# Altium project Pendulum_Project.PrjPcb
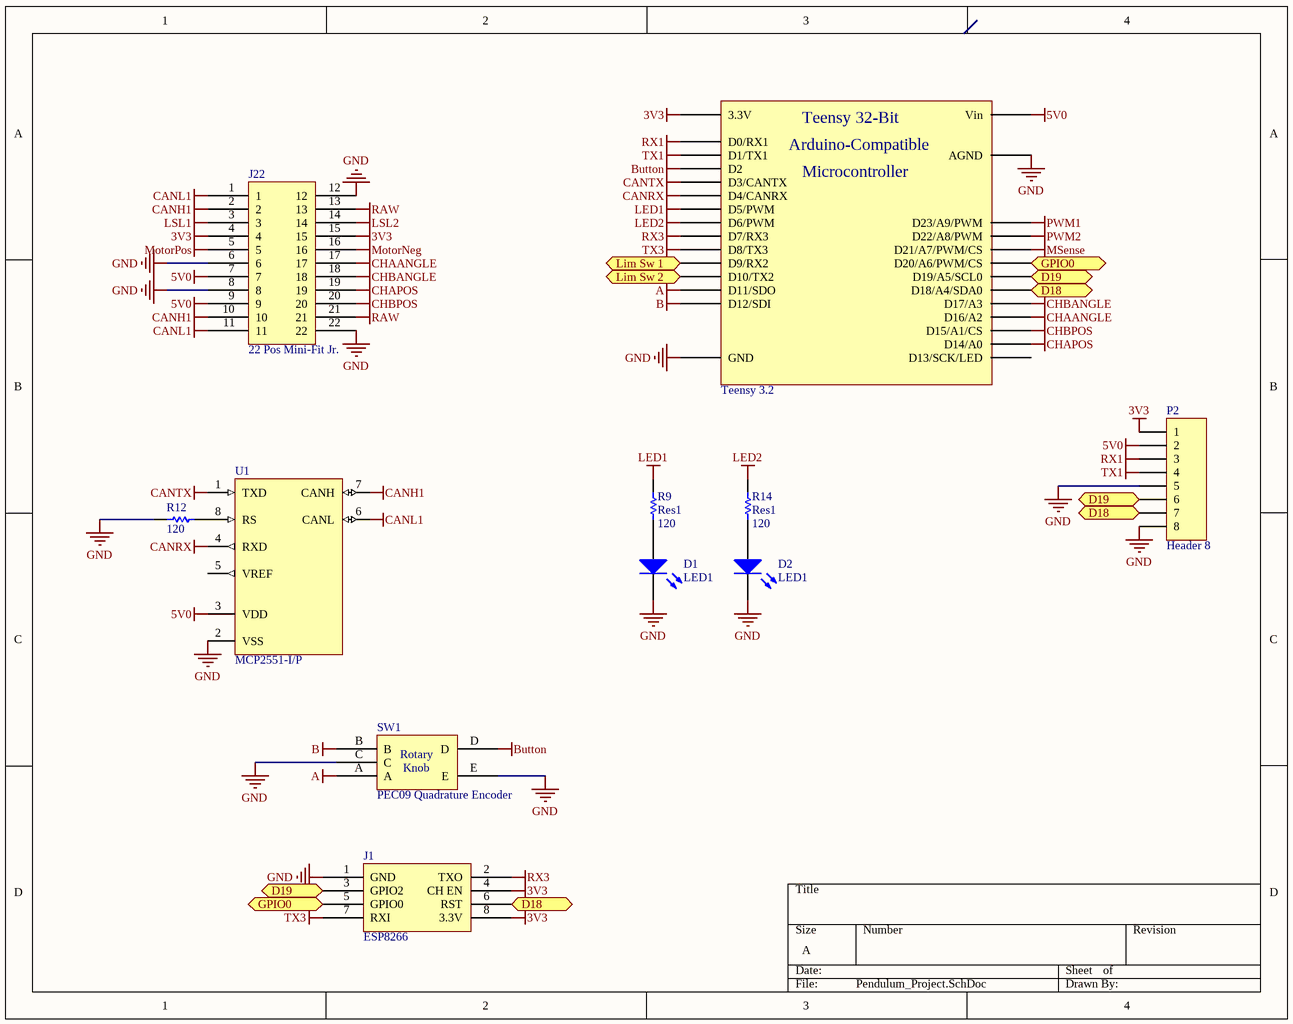
[diagram p0: Pendulum_Project.SchDoc]
2 sheets, 34 parts. Net scope: flat (ports and power ports of the same name join across sheets).
Board file: Pendulum_Project.PcbDoc
Sheets:
  Pendulum_Project.SchDoc
  HBridge_and_Power.SchDoc

## Sheet Pendulum_Project.SchDoc
size A

### Parts
D1  LED1  [5mm Rad LED]
D2  LED1  [5mm Rad LED]
J1  ESP8266  [ESP8266]
J22  22 Pos Mini-Fit Jr.  [22 pos Mini-Fit Jr. R/A Header]
P2  Header 8  [HDR1X8]
R9  Res1  value 120  [AXIAL-0.3]
R12  120  [AXIAL-0.3]
R14  Res1  value 120  [AXIAL-0.3]
SW1  PEC09 Quadrature Encoder  [PEC09 Series Encoder]
Teensy_3.2  Teensy 3.2 Outside  [Teensy 3.2 Outside Only]  (value not drawn)
U1  MCP2551-I/P  [PDIP300-P8]

### Ports
D18, D19, GPIO0, Lim Sw 1, Lim Sw 2

### Nets
3V3: J1.4(CH_EN) J1.8(3.3V) J22.4 J22.15 P2.1 Teensy_3.2.31(3.3V)
5V0: J22.7 J22.9 P2.2 Teensy_3.2.33(Vin) U1.3(VDD)
A: SW1.A Teensy_3.2.2(D11/SDO)
B: SW1.B Teensy_3.2.1(D12/SDI)
Button: SW1.D Teensy_3.2.11(D2)
CANH1: J22.2 J22.10 U1.7(CANH)
CANL1: J22.1 J22.11 U1.6(CANL)
CANRX: Teensy_3.2.9(D4/CANRX) U1.4(RXD)
CANTX: Teensy_3.2.10(D3/CANTX) U1.1(TXD)
CHAANGLE: J22.17 Teensy_3.2.23(D16/A2)
CHAPOS: J22.19 Teensy_3.2.21(D14/A0)
CHBANGLE: J22.18 Teensy_3.2.24(D17/A3)
CHBPOS: J22.20 Teensy_3.2.22(D15/A1/CS)
GND: D1.2(K) D2.2(K) J1.1(GND) J22.6 J22.8 J22.12 J22.22 P2.5 P2.8 R12.2 SW1.C SW1.E Teensy_3.2.14(GND) Teensy_3.2.32(AGND) U1.2(VSS)
LED1: R9.2 Teensy_3.2.8(D5/PWM)
LED2: R14.2 Teensy_3.2.7(D6/PWM)
LSL1: J22.3 Teensy_3.2.4(D9/RX2) ; port Lim Sw 1
LSL2: J22.14 Teensy_3.2.3(D10/TX2) ; port Lim Sw 2
MotorNeg: J22.16
MotorPos: J22.5
MSense: Teensy_3.2.28(D21/A7/PWM/CS)
PWM1: Teensy_3.2.30(D23/A9/PWM)
PWM2: Teensy_3.2.29(D22/A8/PWM)
RAW: J22.13 J22.21
RX1: P2.3 Teensy_3.2.13(D0/RX1)
RX3: J1.2(TXO) Teensy_3.2.6(D7/RX3)
TX1: P2.4 Teensy_3.2.12(D1/TX1)
TX3: J1.7(RXI) Teensy_3.2.5(D8/TX3)
NetD1_1: D1.1(A) R9.1
NetD2_1: D2.1(A) R14.1
NetJ1_3: J1.3(GPIO2) P2.6 Teensy_3.2.26(D19/A5/SCL0) ; port D19
NetJ1_5: J1.5(GPIO0) Teensy_3.2.27(D20/A6/PWM/CS) ; port GPIO0
NetJ1_6: J1.6(RST) P2.7 Teensy_3.2.25(D18/A4/SDA0) ; port D18
NetR12_1: R12.1 U1.8(RS)

Not connected (* = marked no-connect by the designer): Teensy_3.2 20(D13/SCK/LED); U1 5(VREF)

### Notes on the sheet
- (in symbol Quadrature PEC09) Rotary; Knob
- (in symbol Teensy 3.2 Outside) Teensy 32-Bit; Arduino-Compatible; Microcontroller

### Library data of the parts
D1 D2 = LED1: Typical RED GaAs LED; Published: 8-Jun-2000; LatestRevisionDate: 08-Jul-2005; LatestRevisionNote: Mech Layer 1 removed.; PackageReference: LED-1; Publisher: Altium Limited; PackageDescription: LED; 2 Leads
J1 = ESP8266: Sparkfun ESP8266 Module (WRL-13678); Supplier 1: Sparkfun; Supplier Part Number 1: WRL-13678
J22 = 22 Pos Header: Manufacturer: Molex; Supplier 1: Digi-Key; Supplier 2: Mouser; PartNumber: 39-30-1220; Supplier Part Number 2: 538-39-30-1220
P2 = Header 8: Header, 8-Pin; LatestRevisionDate: 17-Jul-2002; LatestRevisionNote: Re-released for DXP Platform.; Publisher: Altium Limited
R9 R14 = Res1: Resistor; Published: 8-Jun-2000; LatestRevisionDate: 17-Jul-2002; LatestRevisionNote: Re-released for DXP Platform.; PackageReference: AXIAL-0.3; Publisher: Altium Limited; PackageDescription: Axial Device, Thru-Hole; 2 Leads; 0.3 in Pin Spacing
R12 = Res1: Resistor; Value: 1K; Published: 8-Jun-2000; LatestRevisionDate: 17-Jul-2002; LatestRevisionNote: Re-released for DXP Platform.; PackageReference: AXIAL-0.3; Publisher: Altium Limited; PackageDescription: Axial Device, Thru-Hole; 2 Leads; 0.3 in Pin Spacing
SW1 = Quadrature PEC09: ENCODER INCREMENTAL W/SWITCH 9MM; Manufacturer: Bourns Inc.; PartNumber: PEC09-2220F-S0012; Supplier 1: Digi-Key; Supplier Part Number 1: PEC09-2220F-S0012-ND
Teensy_3.2 = Teensy 3.2 Outside: 32 Bit Arduino-Compatible Microcontroller; Manufacturer: PRJC; PartNumber: Teensy 3.2; Supplier 1: Sparkfun; Supplier Part Number 1: DEV-13736
U1 = MCP2551-I/P: High-Speed CAN Transceiver, 8-Pin PDIP, Industrial Temperature; Manufacturer: Microchip; DatasheetVersion: revF, Jul-2010; PackageVersion: revBB, Aug-2009; PackageReference: PDIP300-P8; PackageDescription: 8-Lead Plastic Dual In-Line (P) - 300 mil Body [PDIP]; Supplier 1: Digi-Key; Supplier Part Number 1: MCP2551-I/P-ND; Supplier 2: Farnell; Supplier Part Number 2: 1292240; Supplier 3: Newark; Supplier Part Number 3: 61K2947; Supplier 4: Mouser; Supplier Part Number 4: 579-MCP2551-I/P; Mounting Technology: Through Hole; Code_JEDEC: MS-001; PartNumber: MCP2551-I/P; ComponentLink1Description: Manufacturer URL; ComponentLink1URL: http://www.microchip.com/; ComponentLink2Description: Datasheet; ComponentLink2URL: http://ww1.microchip.com/downloads/en/DeviceDoc/21667F.pdf; ComponentLink3Description: Package Specification; ComponentLink3URL: http://www.microchip.com/stellent/groups/techpub_sg/documents/packagingspec/en012702.pdf

## Sheet HBridge_and_Power.SchDoc
size A
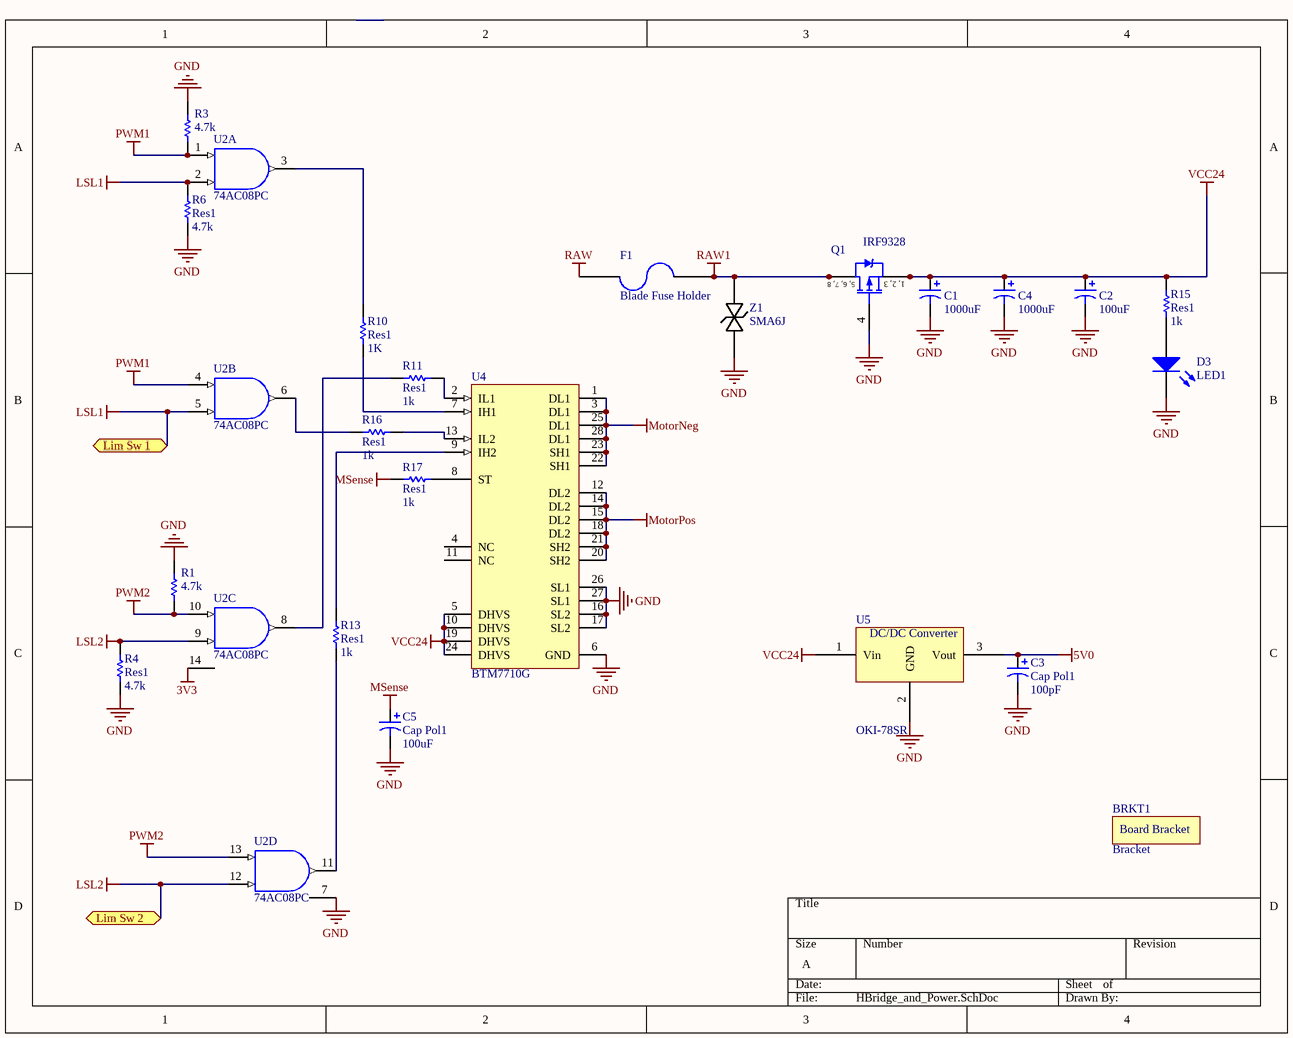
[diagram p1: HBridge_and_Power.SchDoc]

### Parts
BRKT1  Bracket  [Board Bracket]
C1  value 1000uF  [Elec. Cap 5 x 10mm]  (hidden comment: Cap Pol1)
C2  value 100uF  [Elec. Cap 5 x 10mm]  (hidden comment: Cap Pol1)
C3  Cap Pol1  value 100pF  [Elec. Cap 5 x 10mm]
C4  value 1000uF  [Elec. Cap 5 x 10mm]  (hidden comment: Cap Pol1)
C5  Cap Pol1  value 100uF  [Elec. Cap 5 x 10mm]
D3  LED1  [5mm Rad LED]
F1  Blade Fuse Holder  [Fuse Holder]
Q1  IRF9328  [SOIC-8]
R1  value 4.7k  [AXIAL-0.3]  (hidden comment: Res1)
R3  value 4.7k  [AXIAL-0.3]  (hidden comment: Res1)
R4  Res1  value 4.7k  [AXIAL-0.3]
R6  Res1  value 4.7k  [AXIAL-0.3]
R10  Res1  value 1K  [AXIAL-0.3]
R11  Res1  value 1k  [AXIAL-0.3]
R13  Res1  value 1k  [AXIAL-0.3]
R15  Res1  value 1k  [AXIAL-0.3]
R16  Res1  value 1k  [AXIAL-0.3]
R17  Res1  value 1k  [AXIAL-0.3]
U2  74AC08PC  [N14A]  (parts A,B,C,D of 4)
U4  BTM7710G  [INF-PG-DSO-28-22_N]
U5  OKI-78SR  [OKI-78SR]
Z1  SMA6J  [AXIAL-0.9]

### Ports
Lim Sw 1, Lim Sw 2

### Nets
3V3: U2.14(VCC)
5V0: C3.1 U5.3(Vout)
GND: C1.2 C2.2 C3.2 C4.2 C5.2 D3.2(K) Q1.4(G) R1.2 R3.2 R4.1 R6.1 U2.7(GND) U4.6(GND) U4.16(SL2) U4.17(SL2) U4.26(SL1) U4.27(SL1) U5.2(GND) Z1.1(A)
LSL1: R6.2 U2.2(B) U2.5(B) ; port Lim Sw 1
LSL2: R4.2 U2.9(B) U2.12(B) ; port Lim Sw 2
MotorNeg: U4.1(DL1) U4.3(DL1) U4.22(SH1) U4.23(SH1) U4.25(DL1) U4.28(DL1)
MotorPos: U4.12(DL2) U4.14(DL2) U4.15(DL2) U4.18(DL2) U4.20(SH2) U4.21(SH2)
MSense: C5.1 R17.2
PWM1: R3.1 U2.1(A) U2.4(A)
PWM2: R1.1 U2.10(A) U2.13(A)
RAW: F1.1
RAW1: F1.2 Q1.5(D) Q1.6(D) Q1.7(D) Q1.8(D) Z1.2(K)
VCC: U2.14(VCC)
VCC24: C1.1 C2.1 C4.1 Q1.1(S) Q1.2(S) Q1.3(S) R15.2 U4.5(DHVS) U4.10(DHVS) U4.19(DHVS) U4.24(DHVS) U5.1(Vin)
NetD3_1: D3.1(A) R15.1
NetR10_1: R10.1 U4.7(IH1)
NetR10_2: R10.2 U2.3(O)
NetR11_1: R11.1 U4.2(IL1)
NetR11_2: R11.2 U2.8(O)
NetR13_1: R13.1 U2.11(O)
NetR13_2: R13.2 U4.9(IH2)
NetR16_1: R16.1 U4.13(IL2)
NetR16_2: R16.2 U2.6(O)
NetR17_1: R17.1 U4.8(ST)

Not connected (* = marked no-connect by the designer): U4 4(NC) 11(NC)

### Notes on the sheet
- (in symbol 7805) DC/DC Converter
- (in symbol IRF9328 P-FET) 5, 6, 7, 8; 1, 2, 3

### Library data of the parts
BRKT1 = Bracket: Board Bracket; Supplier 1: Digi-Key
C1-C5 = Cap Pol1: Polarized Capacitor (Radial); Published: 8-Jun-2000; LatestRevisionDate: 17-Jul-2002; LatestRevisionNote: Re-released for DXP Platform.; PackageReference: RB7.6-15; Publisher: Altium Limited; PackageDescription: Polarized Capacitor (Radial); 2 Leads
D3 = LED1: Typical RED GaAs LED; Published: 8-Jun-2000; LatestRevisionDate: 08-Jul-2005; LatestRevisionNote: Mech Layer 1 removed.; PackageReference: LED-1; Publisher: Altium Limited; PackageDescription: LED; 2 Leads
F1 = Fuse - Auto: PC Auto-Fuse Holder; Manufacturer: Keystone Electronics; Part Number: 3557-15; Supplier Part Number 1: 36-3557-15-ND; Supplier 1: Digi-Key
Q1 = IRF9328 P-FET: MOSFET P-CH 30V 12A 8-SOIC; Supplier 1: Digi-Key
R1 R3 R4 R6 R10 R11 R13 R15-R17 = Res1: Resistor; Published: 8-Jun-2000; LatestRevisionDate: 17-Jul-2002; LatestRevisionNote: Re-released for DXP Platform.; PackageReference: AXIAL-0.3; Publisher: Altium Limited; PackageDescription: Axial Device, Thru-Hole; 2 Leads; 0.3 in Pin Spacing
U2 = 74AC08PC: Quad 2-Input AND Gate, 14-Pin PDIP, Commercial Grade; IC_Technology: AC; Published: 17-Jul-2002; LatestRevisionDate: 29-May-2009; LatestRevisionNote: Component Body Added.; DatasheetVersion: Nov-1999; PackageVersion: 2000; PackageReference: N14A; Publisher: Altium Limited; PackageDescription: DIP, 14-Pin, Row Spacing 7.62 mm, Pitch 2.54 mm; ComponentLink1Description: Manufacturer Link; ComponentLink1URL: http://www.fairchildsemi.com/; ComponentLink2Description: Datasheet; ComponentLink2URL: http://www.fairchildsemi.com/ds/74%2F74AC08.pdf
U4 = BTM7710G: TrilithIC, 4.5 to 42 V, -40 to 150 degC, PG-DSO-28-22, Reel, Green; Manufacturer: Infineon; Green: TRUE; ID(lim): 15 A; ID(lim) (min): 9 A; Inhibit: FALSE; Iq (typ): 5 uA; Protect: OT, SC; RDS(on) (typ): 110 mOhm; VS (max): 42 V; DatasheetVersion: Rev. 1.0; PackageVersion: Jun-07; PackageReference: PG-DSO-28-22; PackageDescription: 28-Pin Plastic (Green) Dual Small Outline Package, 17.9 x 7.5 mm Body, 1.27 mm Pitch; Supplier 1: Mouser; Supplier Part Number 1: 726-BTM7710G; Supplier 2: Newark; Supplier Part Number 2: 47W3369; Supplier 3: Farnell; Supplier Part Number 3: 2215537; Supplier 4: Digi-Key; Supplier Part Number 4: BTM7710GTR-ND; Supplier 5: Digi-Key; Supplier Part Number 5: BTM7710GCT-ND; Supplier 6: Digi-Key; Supplier Part Number 6: BTM7710GDKR-ND; Group: TrilithIC; Halogen-free: TRUE; Operating Range: 4.5 to 42 V; Mounting Technology: Surface Mount; PartNumber: BTM7710G; ComponentLink1Description: Manufacturer URL; ComponentLink1URL: http://www.infineon.com/; ComponentLink2Description: Datasheet; ComponentLink2URL: http://www.infineon.com/dgdl/BTM7710G%5B1%5D.pdf?folderId=db3a3043156fd5730116144c5d101c30&fileId=db3a30431add1d95011aedf960bb0349&location=en.Products.Automotive_ICs.Motor_Drivers__Automotive_.Integrated_High_Current_Motor_Drivers__NovalithIC____Trilith_IC_.DATASHEET.BTM7710G[1].pdf; ComponentLink3Description: Package Specification; ComponentLink3URL: http://www.infineon.com/dgdl/BTM7700G_DS_10.pdf?folderId=db3a304412b407950112b408e8c90004&fileId=db3a304316f66ee80117642f65ef6a96&sId=db3a30443d67b5ca013d81ef92182d8b
U5 = 7805: 5V DC/DC Converter (7805 replacement); Supplier 1: Digi-Key; Supplier 2: Digi-Key; Supplier Part Number 1: 811-2196-5-ND; Supplier Part Number 2: 811-2692-ND
Z1 = Zener - Bidirectional: TVS DIODE 15VWM 24.4VC SMA; Manufacturer: Micro Commercial Co; PartNumber: SMA6J15CA-TP; Supplier 1: Digi-Key; Supplier Part Number 1: SMA6J15CA-TPMSCT-ND

## Nets that join several sheets
3V3: Pendulum_Project (6 pins), HBridge_and_Power (U2.14)
5V0: Pendulum_Project (5 pins), HBridge_and_Power (C3.1 U5.3)
GND: Pendulum_Project (15 pins), HBridge_and_Power (19 pins)
LSL1: Pendulum_Project (J22.3 Teensy_3.2.4), HBridge_and_Power (R6.2 U2.2 U2.5)
LSL2: Pendulum_Project (J22.14 Teensy_3.2.3), HBridge_and_Power (R4.2 U2.9 U2.12)
MotorNeg: Pendulum_Project (J22.16), HBridge_and_Power (6 pins)
MotorPos: Pendulum_Project (J22.5), HBridge_and_Power (6 pins)
MSense: Pendulum_Project (Teensy_3.2.28), HBridge_and_Power (C5.1 R17.2)
PWM1: Pendulum_Project (Teensy_3.2.30), HBridge_and_Power (R3.1 U2.1 U2.4)
PWM2: Pendulum_Project (Teensy_3.2.29), HBridge_and_Power (R1.1 U2.10 U2.13)
RAW: Pendulum_Project (J22.13 J22.21), HBridge_and_Power (F1.1)